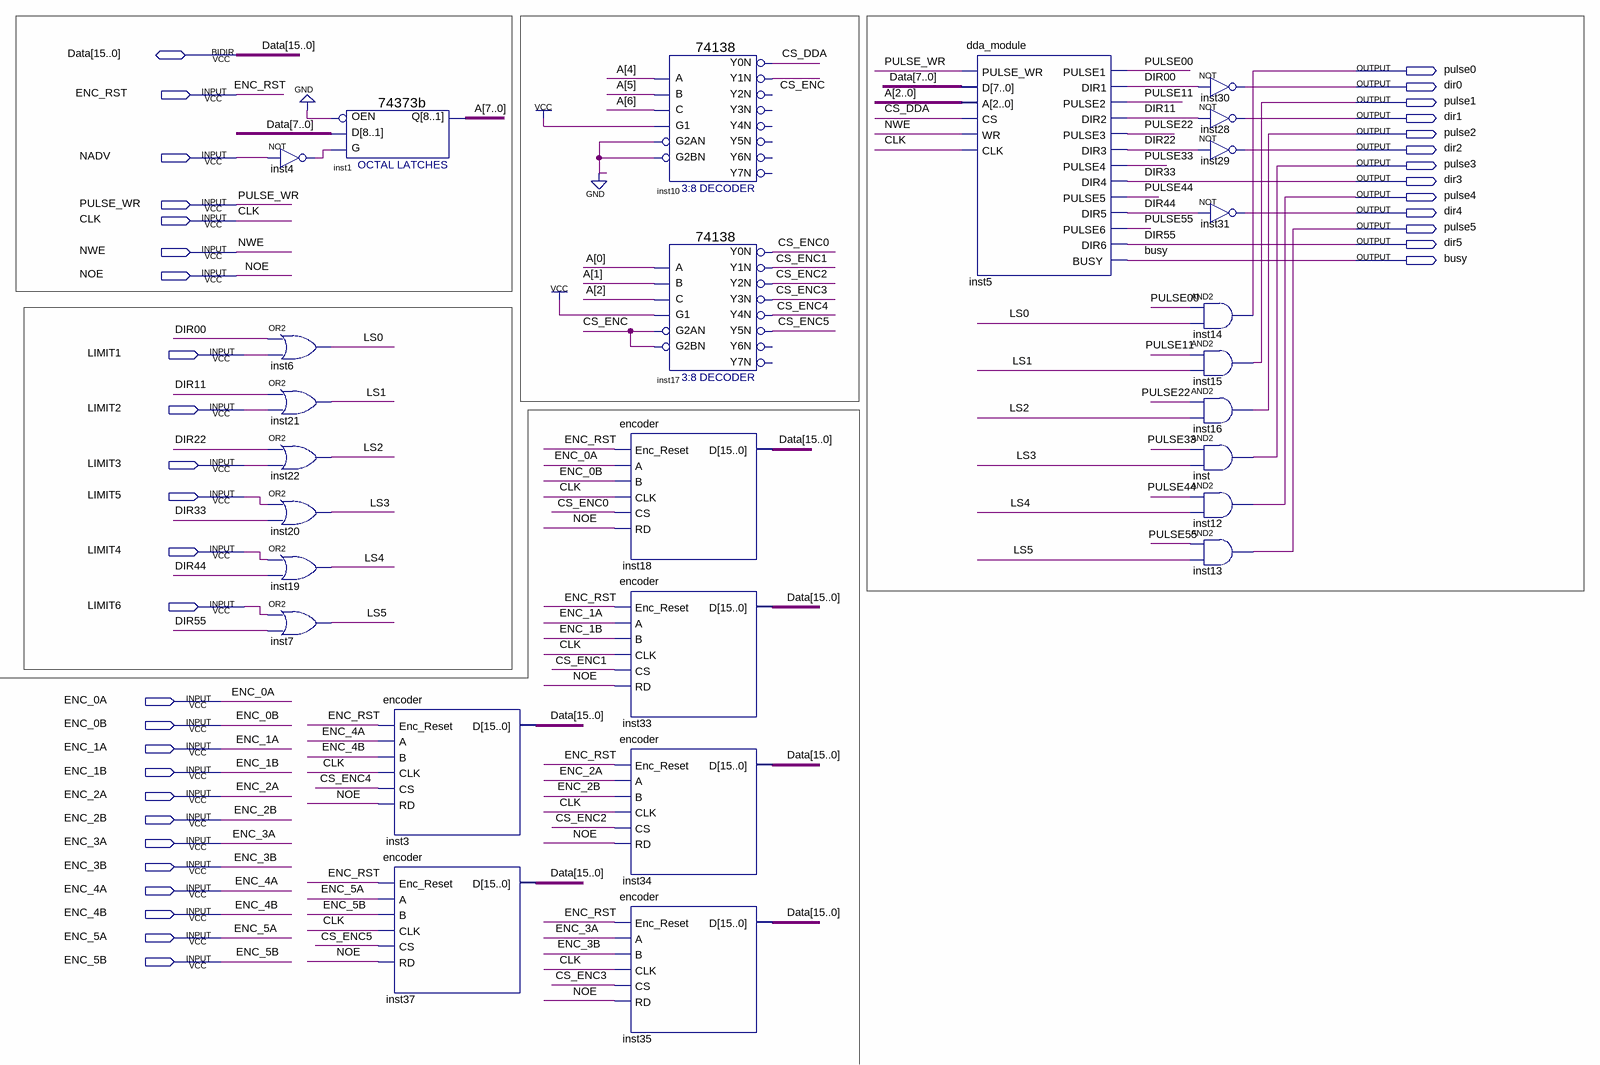
[diagram p0: schematic sheet]
// Quartus schematic xuat_xung.bdf as structural Verilog: 27 symbols, 38 pins
module xuat_xung (
  input  ENC_RST,
  input  NADV,
  input  PULSE_WR,
  input  CLK,
  input  NWE,
  input  NOE,
  input  LIMIT1,
  input  LIMIT2,
  input  LIMIT3,
  input  LIMIT5,
  input  LIMIT4,
  input  LIMIT6,
  input  ENC_0A,
  input  ENC_0B,
  input  ENC_1A,
  input  ENC_1B,
  input  ENC_2A,
  input  ENC_2B,
  input  ENC_3A,
  input  ENC_3B,
  input  ENC_4A,
  input  ENC_4B,
  input  ENC_5A,
  input  ENC_5B,
  inout  [15:0] Data,
  output pulse0,
  output dir0,
  output pulse1,
  output dir1,
  output pulse2,
  output dir2,
  output pulse3,
  output dir3,
  output pulse4,
  output dir4,
  output pulse5,
  output dir5,
  output busy
);

  wire CS_DDA, CS_ENC, CS_ENC0, CS_ENC1, CS_ENC2, CS_ENC3, CS_ENC4, CS_ENC5, DIR00, DIR11, DIR22, DIR44,
       inst4_out, LS0, LS1, LS2, LS3, LS4, LS5, PULSE00, PULSE11, PULSE22, PULSE33, PULSE44, PULSE55;
  wire [7:0] A;

  not inst4 (inst4_out, NADV);
  or inst6 (LS0, DIR00, LIMIT1);
  or inst21 (LS1, DIR11, LIMIT2);
  or inst22 (LS2, DIR22, LIMIT3);
  or inst20 (LS3, LIMIT5, dir3);
  or inst19 (LS4, LIMIT4, DIR44);
  or inst7 (LS5, LIMIT6, dir5);
  \74373b  inst1 (.D(Data[7:0]), .G(inst4_out), .OEN(1'b0), .Q(A));
  encoder inst3 (.Enc_Reset(ENC_RST), .A(ENC_4A), .B(ENC_4B), .CLK(CLK), .CS(CS_ENC4), .RD(NOE), .D(Data));
  encoder inst37 (.Enc_Reset(ENC_RST), .A(ENC_5A), .B(ENC_5B), .CLK(CLK), .CS(CS_ENC5), .RD(NOE), .D(Data));
  encoder inst18 (.Enc_Reset(ENC_RST), .A(ENC_0A), .B(ENC_0B), .CLK(CLK), .CS(CS_ENC0), .RD(NOE), .D(Data));
  encoder inst33 (.Enc_Reset(ENC_RST), .A(ENC_1A), .B(ENC_1B), .CLK(CLK), .CS(CS_ENC1), .RD(NOE), .D(Data));
  encoder inst34 (.Enc_Reset(ENC_RST), .A(ENC_2A), .B(ENC_2B), .CLK(CLK), .CS(CS_ENC2), .RD(NOE), .D(Data));
  encoder inst35 (.Enc_Reset(ENC_RST), .A(ENC_3A), .B(ENC_3B), .CLK(CLK), .CS(CS_ENC3), .RD(NOE), .D(Data));
  \74138  inst10 (
    .A(A[4]), .B(A[5]), .G1(1'b1), .C(A[6]), .G2AN(1'b0), .G2BN(1'b0), .Y0N(CS_DDA), .Y1N(CS_ENC));  // open: Y2N, Y3N, Y4N, Y5N, Y6N, Y7N
  \74138  inst17 (
    .A(A[0]), .B(A[1]), .G1(1'b1), .C(A[2]), .G2AN(CS_ENC), .G2BN(CS_ENC), .Y0N(CS_ENC0), .Y1N(CS_ENC1),
    .Y2N(CS_ENC2), .Y3N(CS_ENC3), .Y4N(CS_ENC4), .Y5N(CS_ENC5));  // open: Y6N, Y7N
  dda_module inst5 (
    .A(A[2:0]), .CS(CS_DDA), .WR(NWE), .CLK(CLK), .D(Data[7:0]), .PULSE_WR(PULSE_WR), .PULSE1(PULSE00),
    .DIR1(DIR00), .PULSE2(PULSE11), .DIR2(DIR11), .PULSE3(PULSE22), .DIR3(DIR22), .PULSE4(PULSE33),
    .DIR4(dir3), .PULSE5(PULSE44), .DIR5(DIR44), .PULSE6(PULSE55), .DIR6(dir5), .BUSY(busy));
  not inst30 (dir0, DIR00);
  not inst28 (dir1, DIR11);
  not inst29 (dir2, DIR22);
  not inst31 (dir4, DIR44);
  and inst14 (pulse0, PULSE00, LS0);
  and inst15 (pulse1, PULSE11, LS1);
  and inst16 (pulse2, PULSE22, LS2);
  and inst (pulse3, PULSE33, LS3);
  and inst12 (pulse4, PULSE44, LS4);
  and inst13 (pulse5, PULSE55, LS5);

  // Other names for the same wires on the sheet: DIR33 = dir3; DIR55 = dir5
endmodule
